# EAGLE design main (EAGLE 9.6.1)
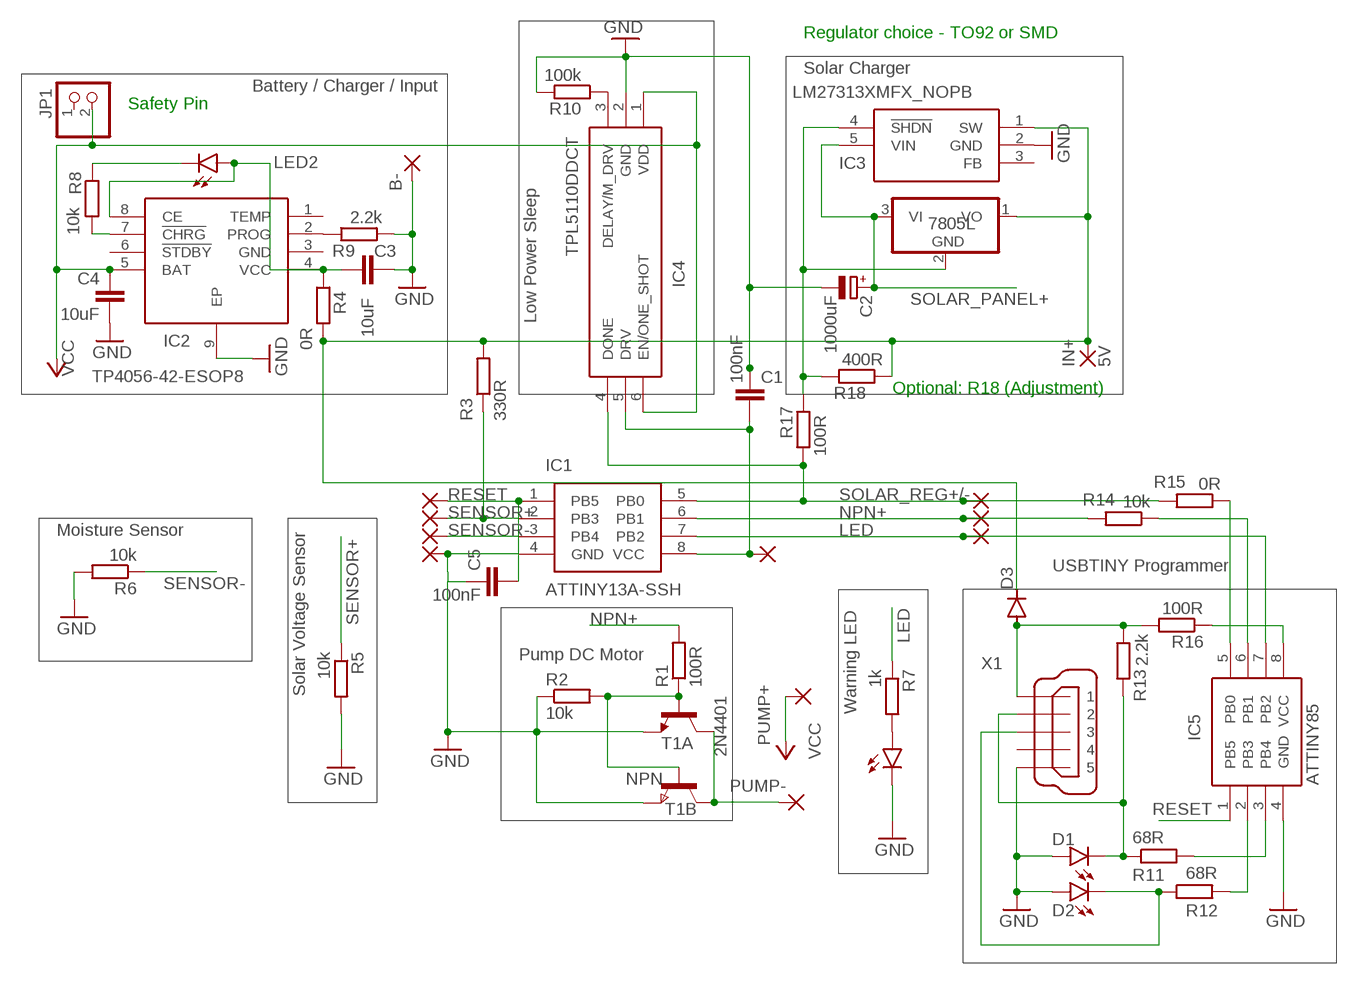
[diagram p0: schematic, sheet 1]

## Parts
B-  1,6/0,8  [1,6/0,8]
C1  100nF  C-EUC0805  [C0805]
C2  1000uF  CPOL-EUE2.5-7  [E2,5-7]
C3  10uF  C-EUC3216  [C3216]
C4  10uF  C-EUC0805  [C0805]
C5  100nF  C-EUC0805  [C0805]
D1  LEDSML0805  [SML0805]
D2  LEDSML0805  [SML0805]
D3  DIODE-MINIMELF  [MINIMELF]
IC1  ATTINY13A-SSH  [SOIC127P600X175-8N]
IC2  TP4056-42-ESOP8  [SOIC127P600X175-9N]
IC3  LM27313XMFX_NOPB  [SOT95P280X145-5N]
IC4  TPL5110DDCT  [SOT95P280X110-6N]
IC5  ATTINY13A-SSH  [SOIC127P600X175-8N]
IN+  5V  1,6/0,9  [1,6/0,9]
JP1  PINHD-1X2  [1X02]
LED1  LEDSML0805  [SML0805]
LED2  LEDSML0805  [SML0805]
PAD3  1,6/0,8  [1,6/0,8]
PAD4  1,6/0,8  [1,6/0,8]
PAD5  1,6/0,8  [1,6/0,8]
PAD6  1,6/0,8  [1,6/0,8]
PAD7  1,6/0,8  [1,6/0,8]
PAD8  1,6/0,8  [1,6/0,8]
PAD9  1,6/0,8  [1,6/0,8]
PAD10  1,6/0,8  [1,6/0,8]
PUMP+  2,15/1,0  [2,15/1,0]
PUMP-  2,15/1,0  [2,15/1,0]
R1  100R  R-EU_R0805  [R0805]
R2  10k  R-EU_R0805  [R0805]
R3  330R  R-EU_R0805  [R0805]
R4  0R  R-EU_M1206  [M1206]
R5  10k  R-EU_R0805  [R0805]
R6  10k  R-EU_R0805  [R0805]
R7  1k  R-EU_R0805  [R0805]
R8  10k  R-EU_R0603  [R0603]
R9  2.2k  R-EU_R0603  [R0603]
R10  100k  R-EU_R0603  [R0603]
R11  68R  R-EU_R0603  [R0603]
R12  68R  R-EU_R0603  [R0603]
R13  2.2k  R-EU_R0603  [R0603]
R14  10k  R-EU_R0402  [R0402]
R15  0R  R-EU_R0402  [R0402]
R16  100R  R-EU_R0603  [R0603]
R17  100R  R-EU_R0603  [R0603]
R18  400R  R-EU_R0603  [R0603]
REG1  7805L  [TO92]
T1A  2N4401  -NPN-TO92  [TO92]
T1B  NPN  NPNSOT23  [SOT-23]
X1  MINI-USB-UX60A-MB-5ST  [UX60A-MB-5ST]

## Nets
GND: B-.1(P) C1.1 C2.- C3.2 C4.2 C5.1 D1.A D2.A IC1.4(GND) IC2.9(EP) IC3.2(GND) IC4.2(GND) IC5.4(GND) LED1.C PAD7.1(P) R2.1 R5.2 R6.2 R9.2 R10.2 T1A.1(E) T1B.2(E) X1.5
LED: IC1.7(PB2) IC5.7(PB2) PAD4.1(P) R7.1
N$1: R1.1 R2.2 T1A.2(B) T1B.3(B)
N$2: PUMP-.1(P) T1A.3(C) T1B.1(C)
N$3: C1.2 IC1.8(VCC) IC4.5(DRV) PAD3.1(P)
N$4: C3.1 IC2.4(VCC) IC2.8(CE) LED2.A R4.2
N$5: D3.C IC3.1(SW) IN+.1(P) R3.2 R4.1 R18.1 REG1.1(VO)
N$6: LED1.A R7.2
N$7: IC4.3(DELAY/M_DRV) R10.1
N$8: IC2.7(!CHRG) R8.2
N$9: LED2.C R8.1
N$10: IC5.3(PB4) R11.2
N$11: IC2.2(PROG) R9.1
N$12: IC5.2(PB3) R12.2
N$13: D1.C R11.1 R13.2 X1.2
N$14: D2.C R12.1 X1.3
N$15: IC5.6(PB1) R14.1
N$16: IC5.5(PB0) R15.1
N$17: IC5.8(VCC) R16.1
N$18: IC3.4(!SHDN) R17.2 R18.2 REG1.2(GND)
N$21: D3.A R13.1 R16.2 X1.1
NPN+: IC1.6(PB1) PAD6.1(P) R1.2 R14.2
RESET: C5.2 IC1.1(PB5) IC5.1(PB5) PAD10.1(P)
SENSOR+: IC1.2(PB3) PAD9.1(P) R3.1 R5.1
SENSOR-: IC1.3(PB4) PAD8.1(P) R6.1
SOLAR_PANEL+: C2.+ IC3.5(VIN) REG1.3(VI)
SOLAR_REG+/-: IC1.5(PB0) IC4.4(DONE) PAD5.1(P) R15.2 R17.1
VCC: C4.1 IC2.5(BAT) IC4.1(VDD) IC4.6(EN/ONE_SHOT) JP1.2 PUMP+.1(P)
Unconnected: IC2.1(TEMP) IC2.3(GND) IC2.6(!STDBY) IC3.3(FB) JP1.1 X1.4

## Notes on the sheet
- Regulator choice - TO92 or SMD
- Solar Charger
- Battery / Charger / Input
- Safety Pin
- Low Power Sleep
- Optional: R18 (Adjustment)
- Moisture Sensor
- USBTINY Programmer
- Pump DC Motor
- Solar Voltage Sensor
- Warning LED
- ATTINY85

## Library data of the parts
B- PAD4-PAD10 = wirepad:1,6/0,8: THROUGH-HOLE PAD
C1 C3-C5 = rcl:C-EU: CAPACITOR, European symbol; SPICEPREFIX: C
C2 = rcl:CPOL-EU: POLARIZED CAPACITOR, European symbol; SPICEPREFIX: C
D1 D2 LED1 LED2 = led:LED: LED OSRAM: - CHIPLED LG R971, LG N971, LY N971, LG Q971, LY Q971, LO R971, LY R971 LH N974, LH R974 LS Q976, LO Q976, LY Q976 LO Q996 - Hyper CHIPLED LW Q18S LB Q993, LB Q99A, LB R99A - SideLED LS A670, LO A670, LY A670, LG A670, LP A670 LB A673, LV A673, LT A673, LW A673 LH A674 LY A675 LS A676, LA A676, LO A676, LY A676, LW A676 LS A679, LY A679, LG A679 - Hyper Micro SIDELED® LS Y876, LA Y876, LO Y876, LY Y876 LT Y87S - SmartLED LW L88C, LW L88S LB L89C, LB L89S, LG L890 LS L89K, LO L89K, LY L89K LS L896, LA L896, LO L896, LY L896 - TOPLED LS T670, LO T670, LY T670, LG T670, LP T670 LSG T670, LSP T670, LSY T670, LOP T670, LYG T670 LG T671, LOG T671, LSG T671 LB T673, LV T673, LT T673, LW T673 LH T674 LS T676, LA T676, LO T676, LY T676, LB T676, LH T676, LSB T676, LW T676 LB T67C, LV T67C, LT T67C, LS T67K, LO T67K, LY T67K, LW E67C LS E67B, LA E67B, LO E67B, LY E67B, LB E67C, LV E67C, LT E67C LW T67C LS T679, LY T679, LG T679 LS T770, LO T770, LY T770, LG T770, LP T770 LB T773, LV T773, LT T773, LW T773 LH T774 LS E675, LA E675, LY E675, LS T675 LS T776, LA T776, LO T776, LY T776, LB T776 LHGB T686 LT T68C, LB T68C - Hyper Mini TOPLED® LB M676 - Mini TOPLED Santana® LG M470 LS M47K, LO M47K, LY M47K Source: http://www.osram.convergy.de LUXEON: - LUMILED® LXK2-PW12-R00, LXK2-PW12-S00, LXK2-PW14-U00, LXK2-PW14-V00 LXK2-PM12-R00, LXK2-PM12-S00, LXK2-PM14-U00 LXK2-PE12-Q00, LXK2-PE12-R00, LXK2-PE12-S00, LXK2-PE14-T00, LXK2-PE14-U00 LXK2-PB12-K00, LXK2-PB12-L00, LXK2-PB12-M00, LXK2-PB14-N00, LXK2-PB14-P00, LXK2-PB14-Q00 LXK2-PR12-L00, LXK2-PR12-M00, LXK2-PR14-Q00, LXK2-PR14-R00 LXK2-PD12-Q00, LXK2-PD12-R00, LXK2-PD12-S00 LXK2-PH12-R00, LXK2-PH12-S00 LXK2-PL12-P00, LXK2-PL12-Q00, LXK2-PL12-R00 Source: www.luxeon.com KINGBRIGHT: KA-3528ASYC Source: www.kingbright.com
D3 = diode:DIODE-: DIODE
IC1 IC5 = STM32F103RBT6:ATTINY13A-SSH: 8-bit Microcontroller with In-System Programmable Flash Source: Datasheet; DESCRIPTION: 8-bit Microcontroller with In-System Programmable Flash; HEIGHT: mm; MANUFACTURER_NAME: Microchip; MANUFACTURER_PART_NUMBER: ATTINY13A-SSH; MOUSER_PART_NUMBER: 556-ATTINY13A-SSH; MOUSER_PRICE-STOCK: https://www.mouser.com/Search/Refine.aspx?Keyword=556-ATTINY13A-SSH; RS_PART_NUMBER: 1330955; RS_PRICE-STOCK: http://uk.rs-online.com/web/p/products/1330955
IC2 = 1EDI60I12AF:TP4056-42-ESOP8: f Source: Datasheet <https://datasheet.lcsc.com/szlcsc/1906261508_Nanjing-Extension-Microelectronics-TP4056-42-ESOP8_C16581.pdf>; DESCRIPTION: f; HEIGHT: 1.75mm; MANUFACTURER_NAME: NanJing Top Power; MANUFACTURER_PART_NUMBER: TP4056-42-ESOP8
IC3 = 1EDI60I12AF:LM27313XMFX_NOPB: TEXAS INSTRUMENTS - LM27313XMFX/NOPB - DC/DC CONV, BUCK, 1.6MHZ, SOT-23 Source: Datasheet <http://www.ti.com/lit/ds/symlink/lm27313.pdf>; DESCRIPTION: TEXAS INSTRUMENTS - LM27313XMFX/NOPB - DC/DC CONV, BUCK, 1.6MHZ, SOT-23; HEIGHT: 1.45mm; MANUFACTURER_NAME: Texas Instruments; MANUFACTURER_PART_NUMBER: LM27313XMFX/NOPB; MOUSER_PART_NUMBER: 926-LM27313XMFX/NOPB; MOUSER_PRICE-STOCK: https://www.mouser.com/Search/Refine.aspx?Keyword=926-LM27313XMFX%2FNOPB
IC4 = SamacSys:TPL5110DDCT: Ultra Low Power Timer with MOS driver and MOSFET Power ON Source: Datasheet <http://www.farnell.com/datasheets/2037314.pdf>; DESCRIPTION: Ultra Low Power Timer with MOS driver and MOSFET Power ON; HEIGHT: 1.1mm; MANUFACTURER_NAME: Texas Instruments; MANUFACTURER_PART_NUMBER: TPL5110DDCT; MOUSER_PART_NUMBER: 595-TPL5110DDCT; MOUSER_PRICE-STOCK: https://www.mouser.com/Search/Refine.aspx?Keyword=595-TPL5110DDCT; RS_PART_NUMBER: 9009867P; RS_PRICE-STOCK: http://uk.rs-online.com/web/p/products/9009867P
IN+ = wirepad:1,6/0,9: THROUGH-HOLE PAD
JP1 = pinhead:PINHD-1X2: PIN HEADER
PAD3 = wirepad:1,6/0,8: THROUGH-HOLE PAD; SPICEPREFIX: X
PUMP+ PUMP- = wirepad:2,15/1,0: THROUGH-HOLE PAD
R1-R7 R10-R18 = resistor:R-EU_: RESISTOR, European symbol
R8 R9 = rcl:R-EU_: RESISTOR, European symbol; SPICEPREFIX: R
REG1 = linear:78*: Positive VOLTAGE REGULATOR Source: http://cache.national.com/ds/LM/LM78L05.pdf http://www.fairchildsemi.com/ds/LM/LM7805.pdf
T1A = transistor:*-NPN-: NPN Transistror BF959 corrected 2008.03.06
T1B = zetex:NPNSOT23: NPN TRANSISTOR; MPN: DSS20201L-7; OC_FARNELL: 1710688; OC_NEWARK: 25R4555
X1 = con-hirose:MINI-USB-: MINI USB Connector Source: http://www.hirose.co.jp/cataloge_hp/e24000019.pdf; OC_FARNELL: unknown; OC_NEWARK: unknown

## Board
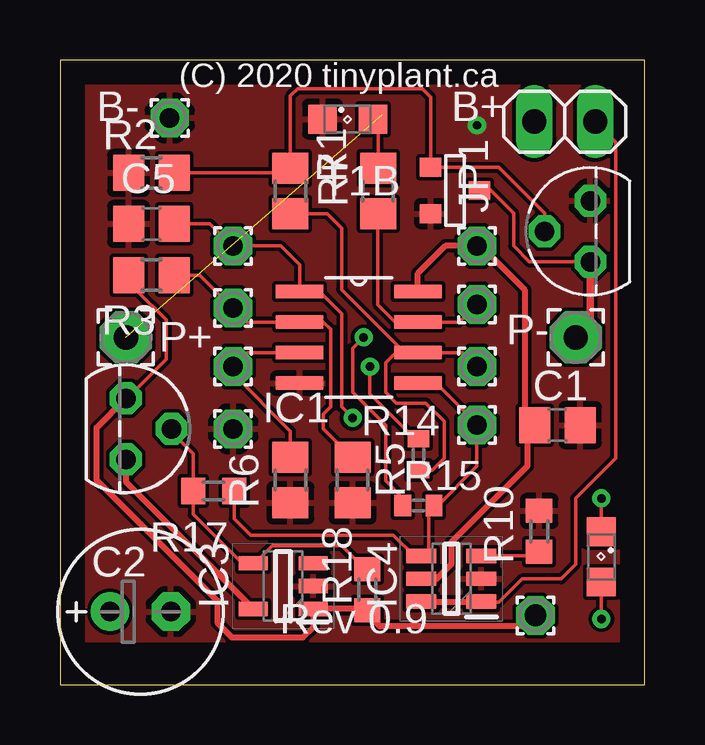
[diagram p1: board, top side]
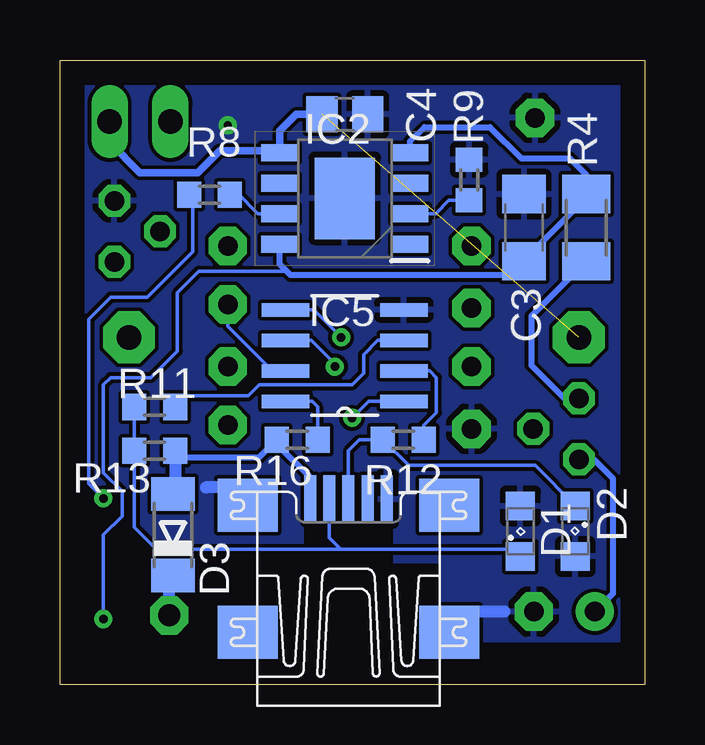
[diagram p2: board, bottom side, seen from below]

Size 24.36 x 26.04 mm. Coordinates in mm from the lower left corner, seen from the top.
Outline: 0,0 24.36,0 24.36,26.04 0,26.04 0,0
Copper layers (1*16): Top 0.035mm / dielectric 1.5mm / Bottom 0.035mm
Design rules "default": minimum track width 6mil, minimum drill 0.35mm, track to track 6mil, track to pad 6mil, pad to pad 6mil, via to via 6mil, smd to smd 6mil, copper to edge 40mil, drill to drill 6mil, minimum pad ring 10mil, minimum via ring 8mil, stop-mask expansion 4mil, vias tented up to drill 0mil, thermal gap 10mil

### Footprints (pad centres in the part's own frame; a part is rotated, then mirrored left to right if it is on the bottom)
1,6/0,8 = drill 0.813 pad 1.6 octagon: 1 0,0
C0805 = smd 1.3 x 1.5: 1 -0.95,0; 2 0.95,0
E2,5-7 = drill 0.813 pad 1.6: + -1.27,0 | drill 0.813 pad 1.6 octagon: - 1.27,0
C3216 = smd 1.6 x 1.8: 1 -1.4,0; 2 1.4,0
SML0805 = smd 1.2 x 1.2: A 1.05,0; C -1.05,0
MINIMELF = smd 1.4 x 1.8: A 1.7,0; C -1.7,0
SOIC127P600X175-8N = smd 1.981 x 0.559: 1 -2.464,1.905; 2 -2.464,0.635; 3 -2.464,-0.635; 4 -2.464,-1.905; 5 2.464,-1.905; 6 2.464,-0.635; 7 2.464,0.635; 8 2.464,1.905
SOIC127P600X175-9N = smd 1.525 x 0.7: 1 -2.712,1.905; 2 -2.712,0.635; 3 -2.712,-0.635; 4 -2.712,-1.905; 5 2.712,-1.905; 6 2.712,-0.635; 7 2.712,0.635; 8 2.712,1.905 | smd 2.513 x 3.402: 9 0,0
SOT95P280X145-5N = smd 1.2 x 0.6: 1 -1.25,0.95; 2 -1.25,0; 3 -1.25,-0.95; 4 1.25,-0.95; 5 1.25,0.95
SOT95P280X110-6N = smd 1.25 x 0.6: 1 -1.25,0.95; 2 -1.25,0; 3 -1.25,-0.95; 4 1.25,-0.95; 5 1.25,0; 6 1.25,0.95
1,6/0,9 = drill 0.914 pad 1.6 octagon: 1 0,0
1X02 = drill 1.016 long: 1 -1.27,0; 2 1.27,0
2,15/1,0 = drill 1.016 pad 2.159 octagon: 1 0,0
R0805 = smd 1.3 x 1.5: 1 -0.95,0; 2 0.95,0
M1206 = smd 1.6 x 2: 1 -1.4,0; 2 1.4,0
R0603 = smd 1 x 1.1: 1 -0.85,0; 2 0.85,0
R0402 = smd 0.7 x 0.9: 1 -0.65,0; 2 0.65,0
TO92 = drill 0.813 octagon: 1 -1.27,0; 2 0,1.905; 3 1.27,0
TO92' = drill 0.813 octagon: 1 1.27,0; 2 0,1.905; 3 -1.27,0
SOT-23 = smd 0.787 x 0.889: 1 0.025,-1.016; 2 -0.94,1.016; 3 0.991,1.016
UX60A-MB-5ST = smd 2 x 0.5: 1 2.25,1.6; 2 2.25,0.8; 3 2.25,0; 4 2.25,-0.8; 5 2.25,-1.6 | smd 2.2 x 2.5: M1 -3.3,-4.2; M2 -3.3,4.2; M3 2,4.2; M4 2,-4.2

### Placement (x,y rotation side)
B-  4.57,23.62 0 top
C1  20.73,10.82 180 top
C2  3.35,3.05 0 top
C3  5.03,19.05 90 bottom
C4  12.5,23.77 0 bottom
C5  3.81,19.2 0 top
D1  5.18,6.4 90 bottom
D2  2.9,6.4 270 bottom
D3  19.66,6.25 90 bottom
IC1  12.45,14.48 0 top
IC2  12.5,20.27 180 bottom
IC3  9.3,4.11 180 top
IC4  16.31,4.42 180 top
IC5  12.5,13.72 180 bottom
IN+  19.81,2.9 90 top
JP1  21.03,23.47 0 top
LED1  11.99,23.57 0 top
LED2  22.56,5.33 270 top
PAD3  17.37,18.29 0 top
PAD4  17.37,15.85 0 top
PAD5  17.37,10.82 0 top
PAD6  17.37,13.26 0 top
PAD7  7.21,10.67 0 top
PAD8  7.21,13.26 0 top
PAD9  7.21,15.7 0 top
PAD10  7.21,18.29 0 top
PUMP+  2.74,14.48 90 top
PUMP-  21.49,14.48 90 top
R1  9.6,20.57 270 top
R2  3.81,21.34 0 top
R3  3.81,17.07 180 top
R4  2.44,19.05 90 bottom
R5  12.19,8.53 270 top
R6  9.6,8.53 270 top
R7  13.26,20.57 90 top
R8  18.14,20.42 0 bottom
R9  7.32,21.03 90 bottom
R10  19.96,6.4 90 top
R11  20.42,11.58 0 bottom
R12  10.06,10.21 0 bottom
R13  20.42,9.75 180 bottom
R14  14.94,9.6 270 top
R15  14.94,7.47 0 top
R16  14.48,10.21 180 bottom
R17  6.4,8.08 180 top
R18  12.8,3.96 90 top
REG1  2.74,10.67 270 top
T1A  2N4401  [TO92']  22.1,18.9 90 top
T1B  16.46,20.57 90 top
X1  12.34,5.49 90 bottom

### Tracks (layer width: path | path; a pad name or v marks a point on that pad's centre or on a via)
GND  (via drill 0.35)
  Bottom 0.152: IC5.4 10.74,15.62
  Bottom 0.305: X1.5 10.74,8.23
  Bottom 0.508: 15.75,8.23 18.29,8.23 | 5.84,3.05 8.38,3.05
  other vias: 17.37,23.32
  pour Top: 1.07,25.15 1.07,1.83 23.32,1.83 23.32,25.15
  pour Bottom: 1.07,25.15 1.07,1.83 23.32,1.83 23.32,25.15
LED
  Top 0.152: PAD4.1 16.64,15.11 IC1.7 13.98,15.11 13.24,15.85 13.24,19.61 R7.1
  Bottom 0.152: PAD4.1 17.37,14.94 15.52,13.08 IC5.7
N$1
  Top 0.152: R2.2 9.41,21.34 R1.1 9.6,24.54 9.91,24.84 15.09,24.84 15.44,24.49 T1B.3 18.29,21.57 20.19,19.66 T1A.2
N$2
  Top 0.152: T1B.1 17.96,20.6 18.9,19.66 18.9,18.29 19.56,17.63 T1A.3
  Top 0.305: T1A.3 22.1,15.09 PUMP-.1
N$3
  Top 0.254: IC1.8 14.91,17.14 16.05,18.29 PAD3.1 17.53,18.29 19.35,16.46 19.35,11.24 C1.2 19.47,10.52 19.47,9.11 16.31,5.94 16.31,5.03 15.7,4.42 IC4.5
N$4  (via drill 0.35)
  Top 0.152: LED2.A v22.56,2.74
  Bottom 0.152: v22.56,2.74 22.56,6.25 21.78,7.03 21.78,8.06 22.56,8.84 22.56,12.5 22.25,12.8 20.57,12.8 19.47,13.91 19.47,16.34 18.58,17.24 14.92,17.24
  Bottom 0.254: IC2.4 9.78,22.63 9.18,23.24 6.45,23.24 5.14,21.94 3.12,21.94 2.44,21.25 R4.2 2.44,20.3 5.03,17.71 C3.1 5.61,17.07 14.75,17.07 14.92,17.24 15.21,17.53 IC2.8
N$5
  Top 0.152: R18.1 12.75,3.17 | REG1.1 2.79,11.94 4.42,13.56 4.42,15.2 3.16,16.46 3.16,16.76 R3.2
  Top 0.254: IN+.1 19.35,2.44 13.32,2.44 12.8,2.96 R18.1 | 12.75,3.17 IC3.1 10.55,2.4 10.12,1.98 7.16,1.98 6.55,2.59 6.55,3.5 1.52,8.53 1.52,10.72 REG1.1
  Bottom 0.152: D3.C 19.68,4.55 19.81,4.42
  Bottom 0.254: REG1.1 3.35,11.94 4.72,13.31 4.72,15.36 R4.1
  Bottom 0.508: IN+.1 19.81,4.42
N$6
  Top 0.152: R7.2 13.26,23.57 LED1.A
N$7
  Top 0.152: R10.1 19.88,5.37 IC4.3
N$8
  Bottom 0.152: R8.2 16.97,20.48 16.12,19.63 IC2.7
N$9  (via drill 0.35)
  Top 0.152: v22.56,7.77 LED2.C
  Bottom 0.152: v22.56,7.77 23.16,8.38 23.16,15.24 22.25,16.15 20.73,16.15 18.83,18.05 18.83,20.27 R8.1
N$10
  Bottom 0.152: R11.2 19.11,12.04 16.52,12.04 16.07,12.5 12.19,12.5 11.71,12.98 11.71,13.76 11.12,14.35 IC5.3
N$11
  Bottom 0.152: IC2.2 8.72,19.63 8.17,20.18 R9.1
N$12
  Bottom 0.152: R12.2 9.21,10.82 8.69,11.34 8.69,12.8 8.97,13.08 IC5.2
N$13
  Bottom 0.152: R11.1 R13.2 21.27,6.57 20.35,5.66 12.67,5.66 | D1.C 5.49,5.66 12.67,5.66 | 12.67,5.66 13.14,6.13 X1.2
N$14
  Bottom 0.152: D2.C 2.9,7.47 4.57,9.14 9.84,9.14 R12.1 11.89,10.21 12.34,9.75 X1.3
N$15  (via drill 0.35)
  Top 0.152: R14.1 14.78,10.25 12.91,12.12 v12.91,13.26
  Bottom 0.152: v12.91,13.26 12.91,13.37 13.89,14.35 IC5.6
N$16  (via drill 0.35)
  Top 0.152: v12.65,14.48 12.19,14.02 12.19,12.19 13.56,10.82 13.56,8.49 14.29,7.77 R15.1
  Bottom 0.152: v12.65,14.48 13.79,15.62 IC5.5
N$17
  Bottom 0.152: IC5.8 13.86,11.81 13.63,11.58 R16.1
N$18
  Top 0.152: REG1.2 4.65,10.53 5.55,9.62 R17.2 5.55,7.1 7.58,5.06 IC3.4 8.11,5.06 8.84,5.79 11.73,5.79 12.71,4.81 R18.2
N$21
  Bottom 0.152: R13.1 19.3,9.49 | R16.2 15.33,10.03 | 19.57,8.04 D3.A
  Bottom 0.254: 19.3,9.49 16.05,9.49 R16.2 | 15.33,10.03 13.94,8.65 X1.1
  Bottom 0.508: R13.1 19.57,8.04
NPN+
  Top 0.152: IC1.6 16.79,13.84 PAD6.1 | IC1.6 14.36,13.84 11.73,16.47 11.73,19.01 11.13,19.62 R1.2 | R14.2 15.5,8.95 16,9.45 16,10.97 15.24,11.74 14.02,11.74 13.56,12.19 13.56,13.41 14,13.84 IC1.6
RESET  (via drill 0.35)
  Top 0.152: v12.19,11.12 11.73,11.58 11.73,15.47 10.82,16.38 IC1.1 9.98,17.5 9.19,18.29 PAD10.1 7.16,18.29 6.25,19.2 C5.2
  Bottom 0.152: v12.19,11.12 11.51,11.81 IC5.1
SENSOR+
  Top 0.152: R3.1 5.83,17.07 7.2,15.7 PAD9.1 7.8,15.11 IC1.2 10.97,15.11 11.28,14.81 11.28,11.58 10.97,11.28 10.97,10.67 12.16,9.48 R5.1
SENSOR-
  Top 0.152: IC1.3 7.8,13.84 PAD8.1 7.21,12.95 9.6,10.57 R6.1
SOLAR_PANEL+
  Top 0.254: REG1.3 2.74,8.47 IC3.5
  Bottom 0.254: C2.+ 1.32,3.81 1.32,8.59 2.13,9.4 REG1.3
SOLAR_REG+/-
  Top 0.152: IC1.5 15.67,12.57 17.37,10.87 PAD5.1 17.37,9.1 15.74,7.47 R15.2 15.36,7.24 15.36,5.37 IC4.4 14.75,5.37 13.88,6.24 7.94,6.24 7.25,6.93 R17.1
VCC  (1 unrouted)
  Top 0.152: IC4.1 17.59,3.43 18.28,3.43 19.26,4.42 20.88,4.42 21.49,5.03 21.49,7.77 23.16,9.45 23.16,22.61 JP1.2
  Top 0.254: IC4.6 IC4.1
  Bottom 0.152: IC2.5 15.21,22.25
  Bottom 0.305: C4.1 14.52,23.77 15.21,23.09 IC2.5 | 15.21,22.25 17.7,22.25 18.62,21.34 21.03,21.34 22.3,22.61 JP1.2

### Text on the board
tNames: (C) 2020 tinyplant.ca | B- | B+ | P+ | P- | Rev 0.9